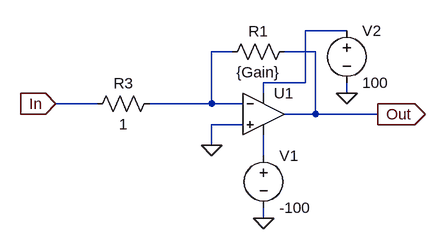
[diagram p0: schematic invertingOpAmp.asc]
invertingOpAmp.asc, the LTspice schematic file:
Version 4.1
SHEET 1 880 680
WIRE 336 48 272 48
WIRE 160 80 128 80
WIRE 288 80 240 80
WIRE 272 128 272 48
WIRE 272 128 208 128
WIRE 208 144 208 128
WIRE 336 144 336 128
WIRE -48 160 -112 160
WIRE 128 160 128 80
WIRE 128 160 32 160
WIRE 176 160 128 160
WIRE 288 176 288 80
WIRE 288 176 240 176
WIRE 384 176 288 176
WIRE 176 192 128 192
WIRE 128 224 128 192
WIRE 208 240 208 208
WIRE 208 336 208 320
FLAG 128 224 0
FLAG -112 160 In
IOPIN -112 160 In
FLAG 384 176 Out
IOPIN 384 176 Out
FLAG 208 336 0
FLAG 336 144 0
SYMBOL res 256 64 R90
WINDOW 0 0 56 VBottom 2
WINDOW 3 32 56 VTop 2
SYMATTR InstName R1
SYMATTR Value {Gain}
SYMBOL res 48 144 R90
WINDOW 0 0 56 VBottom 2
WINDOW 3 32 56 VTop 2
SYMATTR InstName R3
SYMATTR Value 1
SYMBOL OpAmps\\UniversalOpAmp 208 176 R0
SYMATTR InstName U1
SYMBOL voltage 208 224 R0
WINDOW 123 0 0 Left 0
WINDOW 39 0 0 Left 0
SYMATTR InstName V1
SYMATTR Value -100
SYMBOL voltage 336 32 R0
WINDOW 123 0 0 Left 0
WINDOW 39 0 0 Left 0
SYMATTR InstName V2
SYMATTR Value 100

The netlist it stands for:
* invertingOpAmp.asc
R1 Out N002 {Gain}
R3 N002 In 1
X§U1 0 N002 N001 N003 Out level1 Avol=1Meg GBW=10Meg Vos=0 En=0 Enk=0 In=0 Ink=0 Rin=500Meg  ; pins In+ In- V+ V- OUT
V1 N003 0 -100
V2 N001 0 100
.lib UniversalOpAmp1.lib
.backanno
.end